# Altium schematic sheet USB_OTG_FS.SchDoc: USB_OTG_FS
size A4; DocumentNumber: MB1246; Revision: B.1; SheetNumber: 9; SheetTotal: 17; Project: STM32H7xxI-EVAL
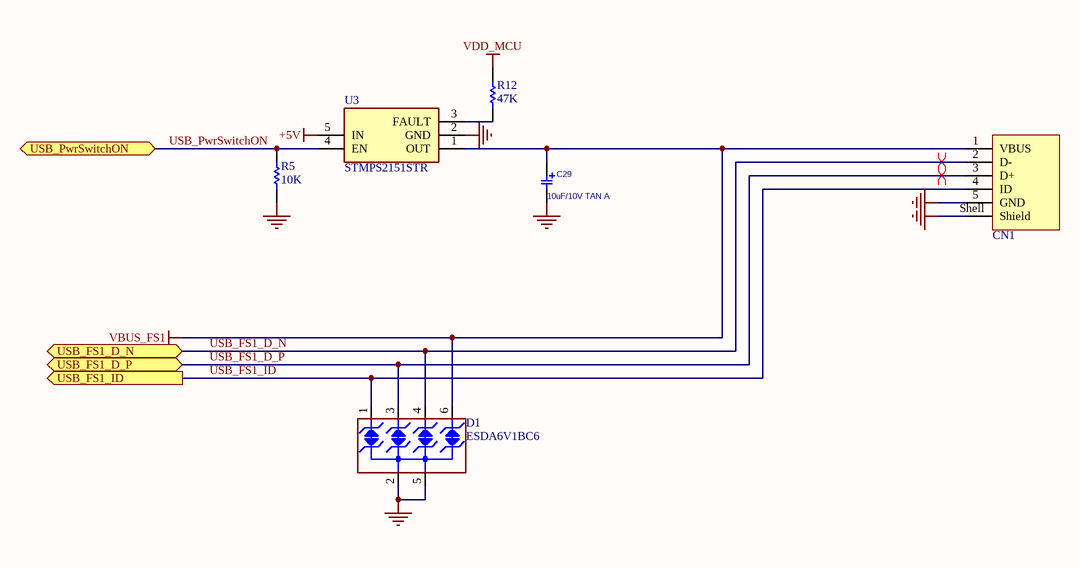
[diagram p0: USB_OTG_FS.SchDoc]

## Parts
C29  10uF/10V TAN A  [C_TN_3216]
CN1  651005136421  [651005136421]  (value not drawn)
D1  ESDA6V1BC6  [SOT95P280X145-6N]
R5  10K  [R0603]
R12  47K  [R0603]
U3  STMPS2151STR  [SOT95P280X145-5N]

## Ports
USB_FS1_D_N (bidir), USB_FS1_D_P (bidir), USB_FS1_ID (out), USB_PwrSwitchON (bidir)

## Nets
+5V: U3.5(IN)
GND: C29.2 CN1.5(GND) CN1.Shell(Shield) D1.2(IO2) D1.5(IO4) R5.2 U3.2(GND)
VBUS_FS1: C29.1 CN1.1(VBUS) D1.6(NC) U3.1(OUT)
VDD_MCU: R12.1
USB_FS1_D_N: CN1.2(D-) D1.4(IO3) ; port USB_FS1_D_N
USB_FS1_D_P: CN1.3(D+) D1.3(GND) ; port USB_FS1_D_P
USB_FS1_ID: CN1.4(ID) D1.1(IO1) ; port USB_FS1_ID
USB_PwrSwitchON: R5.1 U3.4(EN) ; port USB_PwrSwitchON
NetR12_2: R12.2 U3.3(FAULT)

## Layout directives
differential pair: USB_FS1_D_N, USB_FS1_D_P

## Notes on the sheet
- Title:
- Project:
- Size:
- Date:
- A4
- Reference:
- Sheet:
- Revision:
- of

## Library data of the parts
C29 = CAP_SMD_TAN_10uF_6.3V: CAP, SMD, TAN; PARAM: 20%, 300mOhm, -55~105oC; MANF: VISHAY; MANF_P#: T55A106M6R3C0300; PARAM2: 6.3V; VALUE: 10uF; PRICE: 0.46$
CN1 = 651005136421: WR-COM Mini USB 2.0 Type B Vertical 5 Contacts; Manufacturer: Wurth Elektronik; Match Code: WR-USB; Gender: Receptacle; Interface Type: Type B; Number of Ports: 1; Rated Current: 1A; Working Voltage: 30V (AC); Manufacturer Part Number: 651005136421; Category: Input/Output Connectors; ComponentLink1Description: Website Link; ComponentLink1URL: https://www.we-online.com/redexpert/article/651005136421?ad; ComponentLink2Description: Datasheet Link; ComponentLink2URL: https://www.we-online.com/redexpert/spec/651005136421?ad; Mount: Through Hole; Operating Temperature Max: 105°C; Operating Temperature Min: -40°C; Packaging: Tray; Application: Mini USB 2.0; Number of Pins: 5; Orientation: Vertical
D1 = ESDA6V1BC6: 4-line ESD protection; Manuf_1: STM; Manuf_Part_1: ESDA5V3L; Ref St: 9179034; Provided: ST; ECCN_US/EU: EAR99/NEC; Distrib: ST; Order: ESDA5V3L; Ordered by: STM
R5 R12 = res1: Value: 1K; Published: 8-Jun-2000; Revision: July-2002: Re-released for DXP Platform.; Publisher: Altium Limited
U3 = STMPS2151STR: Integrated Circuit; Manufacturer_Name: ST; Datasheet Link: https://www.st.com/resource/en/datasheet/stmps2141.pdf; Height: 1.45mm; Manufacturer_Part_Number: STMPS2151STR